# EAGLE design Adafruit TMC2209 Stepper Motor Driver (EAGLE 9.6.2)
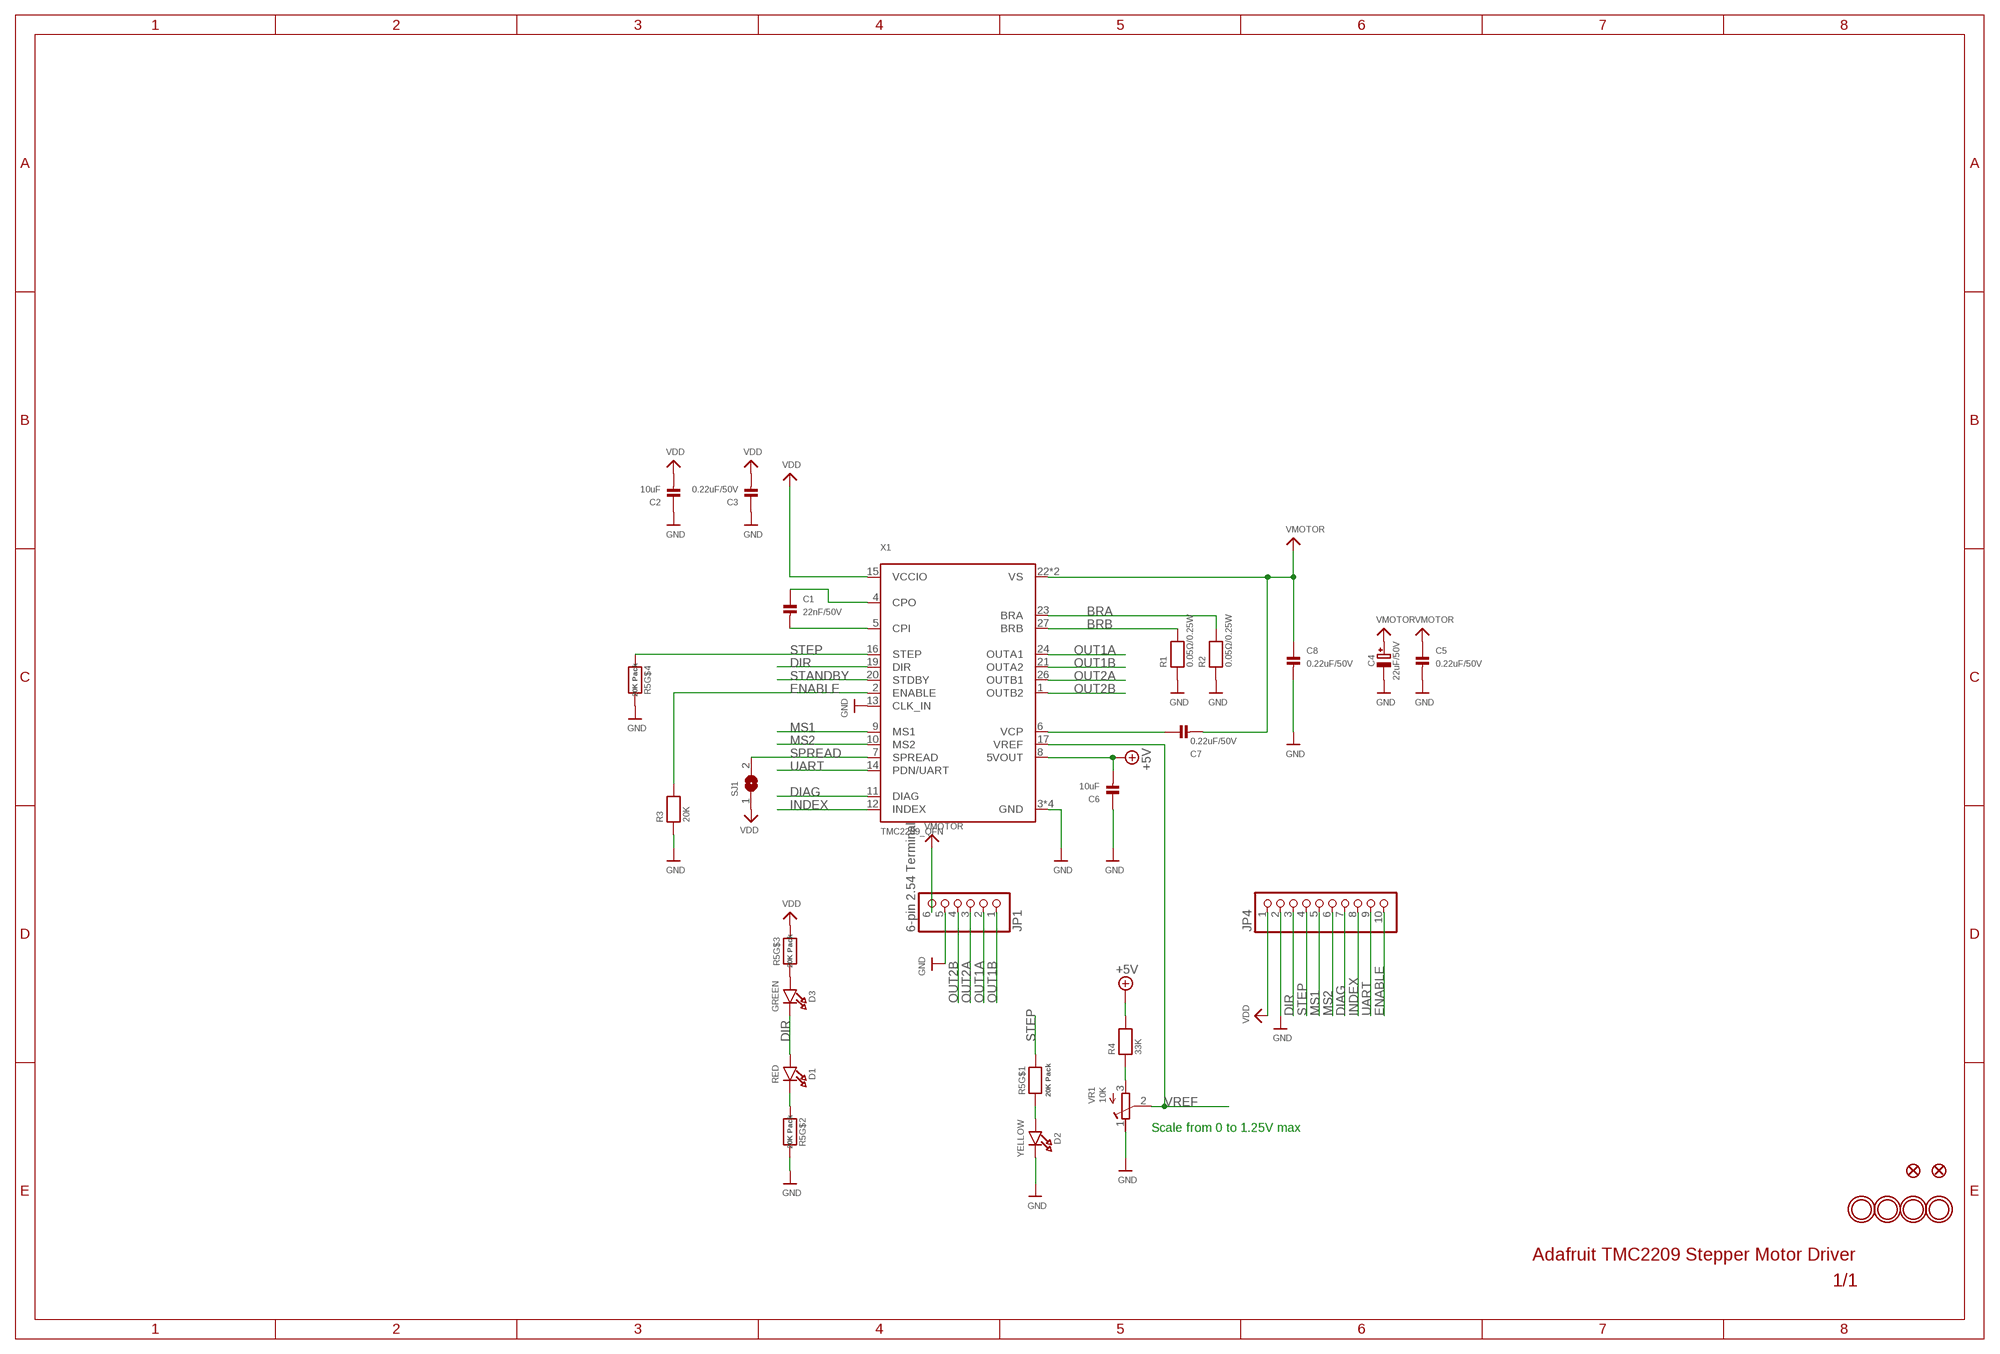
[diagram p0: schematic, sheet 1]

## Parts
C1  22nF/50V  CAP_CERAMIC0603_NO  [0603-NO]
C2  10uF  CAP_CERAMIC0805-NOOUTLINE  [0805-NO]
C3  0.22uF/50V  CAP_CERAMIC0603_NO  [0603-NO]
C4  22uF/50V  CAP_ELECTROLYTICPANASONIC_C  [PANASONIC_C]
C5  0.22uF/50V  CAP_CERAMIC0603_NO  [0603-NO]
C6  10uF  CAP_CERAMIC0805-NOOUTLINE  [0805-NO]
C7  0.22uF/50V  CAP_CERAMIC0603_NO  [0603-NO]
C8  0.22uF/50V  CAP_CERAMIC0603_NO  [0603-NO]
D1  RED  LED0603_NOOUTLINE  [CHIPLED_0603_NOOUTLINE]
D2  YELLOW  LED0603_NOOUTLINE  [CHIPLED_0603_NOOUTLINE]
D3  GREEN  LED0603_NOOUTLINE  [CHIPLED_0603_NOOUTLINE]
JP1  6-pin 2.54 Terminal  HEADER-1X6_2.54MMTERM  [1X06_2.54MMTERMINAL]
JP4  HEADER-1X1070MIL  [1X10_ROUND70]
R1  0.05Ω/0.25W  RESISTOR_0603_NOOUT  [0603-NO]
R2  0.05Ω/0.25W  RESISTOR_0603_NOOUT  [0603-NO]
R3  20K  RESISTOR_0603_NOOUT  [0603-NO]
R4  33K  RESISTOR_0603_NOOUT  [0603-NO]
R5  20K Pack  RESISTOR_4PACK  [RESPACK_4X0603]
SJ1  SOLDERJUMPER  [SOLDERJUMPER_ARROW_NOPASTE]
U$10  FIDUCIAL_0.5MM  [FIDUCIAL_0.5MM]
U$11  FIDUCIAL_0.5MM  [FIDUCIAL_0.5MM]
U$18  MOUNTINGHOLE2.0  [MOUNTINGHOLE_2.0_PLATED]
U$22  MOUNTINGHOLE2.0  [MOUNTINGHOLE_2.0_PLATED]
U$26  MOUNTINGHOLE2.0  [MOUNTINGHOLE_2.0_PLATED]
U$27  MOUNTINGHOLE2.0  [MOUNTINGHOLE_2.0_PLATED]
VR1  10K  R-TRIMM3314J  [RTRIM3314J]
X1  TMC2209_QFN  [QFN28_5MM_MICROCHIP]

## Nets
+5V: C6.2 R4.2 X1.8(5VOUT)
BRA: R2.2 X1.23(BRA)
BRB: R1.2 X1.27(BRB)
DIAG: JP4.7 X1.11(DIAG)
DIR: D1.A D3.C JP4.3 X1.19(DIR)
ENABLE: JP4.10 R3.2 X1.2(ENABLE)
GND: C2.1 C3.1 C4.- C5.2 C6.1 C8.2 D2.C JP1.5 JP4.2 R1.1 R2.1 R3.1 R5.5 R5.7 VR1.1(E) X1.3(GND) X1.13(CLK_IN) X1.18(GND) X1.25(GND) X1.THERMAL(GND)
INDEX: JP4.8 X1.12(INDEX)
MS1: JP4.5 X1.9(MS1)
MS2: JP4.6 X1.10(MS2)
N$1: D2.A R5.1
N$2: C1.1 X1.4(CPO)
N$3: C1.2 X1.5(CPI)
N$4: R4.1 VR1.3(A)
N$7: C7.1 X1.6(VCP)
N$8: D1.C R5.2
N$10: D3.A R5.3
OUT1A: JP1.2 X1.24(OUTA1)
OUT1B: JP1.1 X1.21(OUTA2)
OUT2A: JP1.3 X1.26(OUTB1)
OUT2B: JP1.4 X1.1(OUTB2)
SPREAD: SJ1.2 X1.7(SPREAD)
STANDBY: X1.20(STDBY)
STEP: JP4.4 R5.4 R5.8 X1.16(STEP)
UART: JP4.9 X1.14(PDN/UART)
VDD: C2.2 C3.2 JP4.1 R5.6 SJ1.1 X1.15(VCCIO)
VMOTOR: C4.+ C5.1 C7.2 C8.1 JP1.6 X1.22(VS) X1.28(VS)
VREF: VR1.2(S) X1.17(VREF)

## Notes on the sheet
- Scale from 0 to 1.25V max

## Library data of the parts
C1-C3 C5-C8 = microbuilder:CAP_CERAMIC: Ceramic Capacitors For new designs, use the packages preceded by an '_' character since they are more reliable: The following footprints should be used on most boards: _0402 - Standard footprint for regular board layouts _0603 - Standard footprint for regular board layouts _0805 - Standard footprint for regular board layouts _1206 - Standard footprint for regular board layouts For extremely tight-pitch boards where space is at a premium, the following 'micro-pitch' footprints can be used (smaller pads, no silkscreen outline, etc.): _0402MP - Micro-pitch footprint for very dense/compact boards _0603MP - Micro-pitch footprint for very dense/compact boards _0805MP - Micro-pitch footprint for very dense/compact boards _1206MP - Micro-pitch footprint for very dense/compact boards
C4 = microbuilder:CAP_ELECTROLYTIC: Electrolytic Capacitors SMT PANASONIC_C - Size C Panasonic Electrolytic Aluminum Capacitor 47µF 16V 20% Electrolytic Capacitor [Digikey: PCE3890TR-ND] PANASONIC_D - Size D Panasonic Electrolytic Aluminum Capacitor 100µF 25V 20% Electrolytic Capacitor [Digikey: PCE3898TR-ND] PTH 3.5 mm grid, 8 mm diameter ... 3.5 mm grid, 10 mm diameter ...
D1-D3 = microbuilder:LED: LED 0603 - 0603 Surface Mount Package 2mA: Green LED - Low Power (3.9mcd, 2ma, 1.7Vf) - Digikey: 475-2709-2-ND Orange LED - Low Power (9.8mcd, 2ma, 1.8Vf) - Digikey: 475-1194-2-ND Red LED - Low Power (5mcd, 2ma, 1.8Vf) - Digikey: 475-1195-2-ND Yellow LED - Low Power (7mcd, 2ma, 1.8Vf) - Digikey: 475-1196-2-ND 5mA: Blue LED - Low Power (17mcd, 5ma, 2.9Vf) - Digikey: LNJ937W8CRACT-ND 0805 - 0805 Surface Mount Package 2mA: Red LED (8.8mcd, 2mA, 1.8Vf, Clear) - Low Power [Digikey: 475-2510-1-ND] Green LED (5mcd, 2mA, 1.8Vf, Clear) - Low Power [Digikey: 475-2730-1-ND] Yellow LED (11.3mcd, 2mA, 1.8Vf, Clear) - Low Power [Digikey: 475-2555-1-ND] 20mA: Red LED (104mcd, 20mA, Diffused) - LS R976 [Digikey: 475-1278-6-ND] Red LED (12mcd, 20mA, 2.0Vf, Clear) - APT2012EC [Digikey: 754-1128-1-ND] Green LED (15mcd, 20mA, 2.2Vf, Clear) - APT2012GC [Digikey: 754-1131-1-ND] Orange LED (160mcd, 20mA, 2.1Vf, Clear) - APT2012SECK [Digikey: 754-1130-1-ND] 1206 - 1206 Surface Mount Package Green LED (26mcd, 20mA, Diffused) - LG N971 [Digikey: 475-1407-6-ND] Red LED (15mcd, 20mA, Diffused) - LH N974 [Digikey: 475-1416-6-ND] Cree - Cree High-Power Surface Mount LEDs XPEBWT-L1-0000-00D50 - White 111lm 350mA 2.9Vf 6200K 110° XTEAWT-00-0000-00000LEE3 - White 114lm 350mA 2.85Vf 5000K 115° Everlight - Everlight 45-21 Series Surface Mount LEDs 45-21/QK2C-B2832AC2CB2/2T - Warm White 2000mcd 20mA 3.25Vf 3050K 120° 45-21/LK2C-B38452C4CB2/2T - Nuetral White 2000mcd 20mA 3.25Vf 4150K 120° 45-21/LK2C-B50634C6CB2/2T - Cold White 2200mcd 20mA 3.25Vf 5650K 120° PLCC2 Reverse Mount LS T77K-J1L2-1-0-2-R18-Z - Red 11.25mcd 2mA 1.8Vf 630nm 120° LO T77K-L1M2-24-Z - Orange 19.6mcd 2mA 1.8Vf 606nm 120° LY T77K-K2M1-26-Z - Yellow 15.7mcd 2mA 1.8Vf 587nm 120°; ROT: 270
JP1 = microbuilder:HEADER-1X6: PIN HEADER
JP4 = microbuilder:HEADER-1X10: PIN HEADER
R1-R4 = microbuilder:RESISTOR: Resistors For new designs, use the packages preceded by an '_' character since they are more reliable: The following footprints should be used on most boards: _0402 - Standard footprint for regular board layouts _0603 - Standard footprint for regular board layouts _0805 - Standard footprint for regular board layouts _1206 - Standard footprint for regular board layouts For extremely tight-pitch boards where space is at a premium, the following 'micro-pitch' footprints can be used (smaller pads, no silkscreen outline, etc.): _0402MP - Micro-pitch footprint for very dense/compact boards _0603MP - Micro-pitch footprint for very dense/compact boards _0805MP - Micro-pitch footprint for very dense/compact boards _1206MP - Micro-pitch footprint for very dense/compact boards
R5 = microbuilder:RESISTOR_4PACK: Resistor Packs (4 resistors) 4 x 0603 10K 1/16W - Digikey: YC164J-10KCT-ND
SJ1 = microbuilder:SOLDERJUMPER: SMD Solder JUMPER Solder the two pads together to create a connection, or remove the solder to break it. REFLOW - Use this footprint for solder paste and reflow ovens. WAVE - Use this footprint for hand-soldering (larger pads). CLOSED - Has a trace between the two pads to ensure it is closed by default. The trace needs to be cut to disable the jumper, and can be closed again by creating a solder bridge between the two pads.; BOM: EXCLUDE
U$10 U$11 = microbuilder:FIDUCIAL: Fiducial Alignment Points Various fiducial points for machine vision alignment.
U$18 U$22 U$26 U$27 = adafruit_electromech:MOUNTINGHOLE: Mounting Hole For #2 screws (0.086"/2.18mm width, 0.094"/2.4mm hole) use 2.5mm; BOM: EXCLUDE
VR1 = adafruit_electromech:R-TRIMM: Trimm resistor; SPICEMODEL: X; SPICEPREFIXL: POT
X1 = microbuilder:TMC2209

## Board
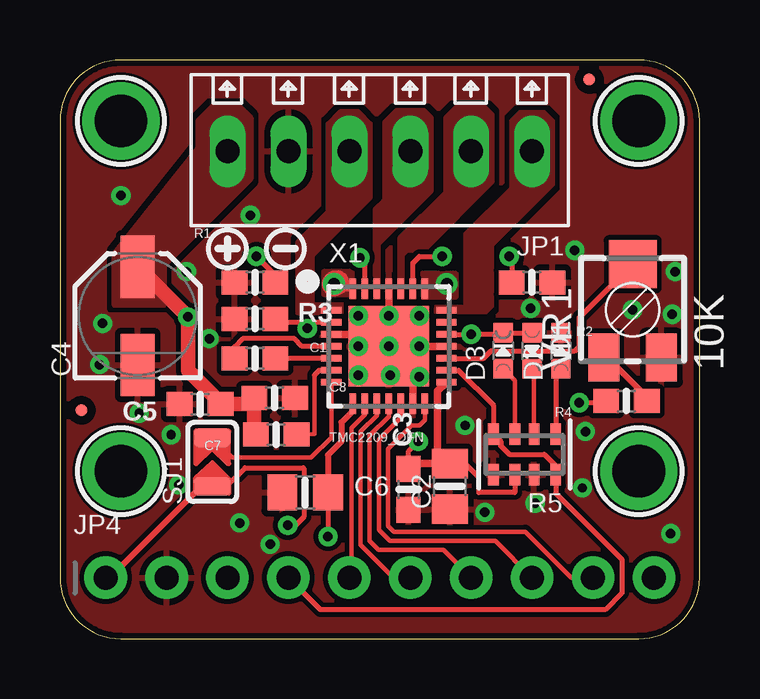
[diagram p1: board, top side]
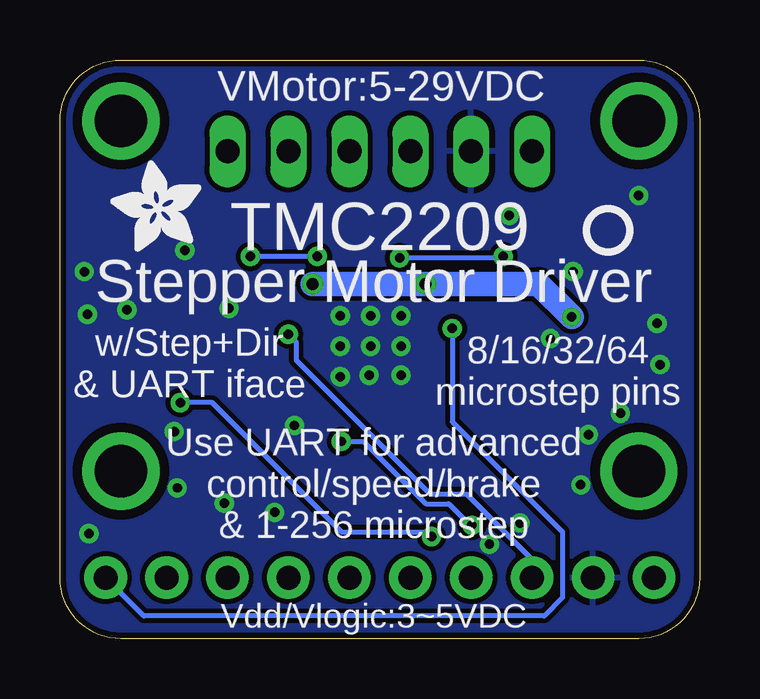
[diagram p2: board, bottom side, seen from below]

Size 26.67 x 24.13 mm. Coordinates in mm from the lower left corner, seen from the top.
Outline: 0,21.59 0,2.54 arc90 2.54,0 24.13,0 arc90 26.67,2.54 26.67,21.59 arc90 24.13,24.13 2.54,24.13 arc90 0,21.59
Copper layers (1*16): Top 0.035mm / dielectric 1.5mm / Bottom 0.035mm
Design rules "adafruit 7-7": minimum track width 7mil, minimum drill 15.5mil, track to track 8mil, track to pad 7mil, pad to pad 7mil, via to via 7mil, smd to smd 7mil, copper to edge 10mil, drill to drill 8mil, minimum pad ring 10mil, minimum via ring 8mil, stop-mask expansion 2mil, vias tented up to drill 20mil, thermal gap 10mil

### Footprints (pad centres in the part's own frame; a part is rotated, then mirrored left to right if it is on the bottom)
0603-NO = smd 1.075 x 1: 1 -0.85,0; 2 0.85,0
0805-NO = smd 1.24 x 1.5: 1 -0.95,0; 2 0.95,0
PANASONIC_C = smd 2.6 x 1.4: + 2.05,0; - -2.05,0
CHIPLED_0603_NOOUTLINE = smd 0.8 x 0.8: A 0,-0.75; C 0,0.75
1X06_2.54MMTERMINAL = drill 1 long: 1 6.35,0; 2 3.81,0; 3 1.27,0; 4 -1.27,0; 5 -3.81,0; 6 -6.35,0
1X10_ROUND70 = drill 1 pad 1.778: 1 -11.43,0; 2 -8.89,0; 3 -6.35,0; 4 -3.81,0; 5 -1.27,0; 6 1.27,0; 7 3.81,0; 8 6.35,0; 9 8.89,0; 10 11.43,0
RESPACK_4X0603 = smd 0.45 x 0.9: 1 -1.3,-0.85; 2 -0.4,-0.85; 3 0.4,-0.85; 4 1.3,-0.85; 5 1.3,0.85; 6 0.4,0.85; 7 -0.4,0.85; 8 -1.3,0.85
SOLDERJUMPER_ARROW_NOPASTE = smd 0.762 x 1.524: 1 -1.016,0; 2 1.016,0
FIDUCIAL_0.5MM = smd 0.5 x 0.5: 1 0,0
MOUNTINGHOLE_2.0_PLATED = drill 2.2 pad 3: P$1 0,0
RTRIM3314J = smd 1.3 x 2: 1 1.2,-2; 3 -1.2,-2 | smd 2 x 2: 2 0,1.9
QFN28_5MM_MICROCHIP = smd 0.85 x 0.27: 1 -2.4,1.5; 2 -2.4,1; 3 -2.4,0.5; 4 -2.4,0; 5 -2.4,-0.5; 6 -2.4,-1; 7 -2.4,-1.5; 15 2.4,-1.5; 16 2.4,-1; 17 2.4,-0.5; 18 2.4,0; 19 2.4,0.5; 20 2.4,1; 21 2.4,1.5 | smd 0.27 x 0.85: 8 -1.5,-2.4; 9 -1,-2.4; 10 -0.5,-2.4; 11 0,-2.4; 12 0.5,-2.4; 13 1,-2.4; 14 1.5,-2.4; 22 1.5,2.4; 23 1,2.4; 24 0.5,2.4; 25 0,2.4; 26 -0.5,2.4; 27 -1,2.4; 28 -1.5,2.4 | smd 3.35 x 3.35: THERMAL 0,0

### Placement (x,y rotation side)
C1  8.13,11.68 0 top
C2  16.26,6.35 90 top
C3  14.54,6.22 90 top
C4  3.24,13.46 90 top
C5  5.84,9.78 180 top
C6  10.22,6.1 0 top
C7  9.02,8.51 180 top
C8  8.95,10.03 0 top
D1  19.68,12 180 top
D2  20.89,12 0 top
D3  18.48,12 0 top
JP1  13.34,20.32 0 top
JP4  13.34,2.54 0 top
PLABEL0  [PLABEL0]  2.03,4.19 0 top
PLABEL1  [PLABEL1]  9.91,0.89 0 top
PLABEL2  [PLABEL2]  7.11,4.19 0 top
PLABEL3  [PLABEL3]  22.35,4.19 0 top
PLABEL4  [PLABEL4]  19.81,0.89 0 top
PLABEL5  [PLABEL5]  24.45,0.89 0 top
PLABEL6  [PLABEL6]  12,4.19 0 top
PLABEL7  [PLABEL7]  14.86,0.89 0 top
PLABEL8  [PLABEL8]  17.14,4.06 0 top
PLABEL9  [PLABEL9]  4.57,0.89 0 top
PLABEL10  [PLABEL10]  12.06,16.32 0 top
PLABEL11  [PLABEL11]  14.67,16.32 0 top
PLABEL12  [PLABEL12]  17.27,16.32 0 top
PLABEL13  [PLABEL13]  19.94,16.26 0 top
PLABEL14  [PLABEL14]  23.94,18.8 0 top
PLABEL15  [PLABEL15]  24,17.4 0 top
PLABEL16  [PLABEL16]  2.6,18.29 0 top
PLABEL17  [PLABEL17]  18.41,10.1 0 top
PLABEL18  [PLABEL18]  19.75,10.1 0 top
PLABEL19  [PLABEL19]  20.89,10.1 0 top
PLABEL20  [PLABEL20]  8,6.67 90 top
R1  8.13,14.86 0 top
R2  19.68,14.86 180 top
R3  8.13,13.34 0 top
R4  23.62,9.91 180 top
R5  19.37,7.68 180 top
SJ1  6.35,7.37 90 top
U$7  [SYMBOL_PLUS]  6.99,16.26 0 top
U$8  [SYMBOL_MINUS]  9.4,16.26 0 top
U$10  22.07,23.32 0 top
U$11  0.89,9.53 0 top
U$12  [PCBFEAT-REV-040]  3.81,17.02 0 bottom
U$18  2.54,21.59 0 top
U$22  24.13,21.59 0 top
U$24  [ADAFRUIT_3.5MM]  20.76,16.13 90 bottom
U$26  2.54,6.99 0 top
U$27  24.13,6.99 0 top
VR1  23.88,13.72 0 top
X1  13.72,12.19 0 top

### Tracks (layer width: path | path; a pad name or v marks a point on that pad's centre or on a via)
+5V  (via drill 0.39)
  Top 0.203: C6.2 v11.18,4.25 | v21.65,9.84 22.71,9.84 R4.2
  Top 0.254: X1.8 12.22,9.5 11.73,9.02 11.73,8.22 11.17,7.66 C6.2
  Bottom 0.203: v11.18,4.25 11.37,4.45 14.92,4.45 20.32,9.84 v21.65,9.84
BRA  (via drill 0.39)
  Top 0.203: X1.23 14.72,15.67 14.99,15.94 v15.94,15.94 | v18.73,15.94 18.84,15.84 R2.2
  Bottom 0.203: v15.94,15.94 v18.73,15.94
BRB  (via drill 0.39)
  Top 0.203: X1.27 12.72,15.68 v12.51,15.88 | v8.19,15.94 8.98,15.15 R1.2
  Bottom 0.203: v12.51,15.88 8.25,15.88 v8.19,15.94
DIAG
  Top 0.178: X1.11 13.72,9.27 12.92,8.47 12.92,4.07 13.29,3.7 15.99,3.7 JP4.7
DIR  (via drill 0.39)
  Top 0.203: X1.19 v17.14,12.69 18.42,12.69 D3.C D1.A
  Bottom 0.203: v17.14,12.69 16.82,12.37 16.82,11.61 11.24,6.03 9.72,6.03 6.99,3.3 JP4.3
ENABLE  (via drill 0.39)
  Top 0.203: X1.2 10.48,13.19 | 10.48,13.19 9.12,13.19 R3.2 | 10.48,13.19 10.31,13.03 v10.31,12.94
  Bottom 0.203: v10.31,12.94 10.31,9.04 5.71,4.45 5.71,1.71 6.48,0.95 23.18,0.95 JP4.10
GND  (via drill 0.39)
  Top 0.305: X1.13 14.72,11.19 X1.THERMAL | X1.3 13.22,12.69 13.53,12.38 | 13.53,12.38 X1.THERMAL | X1.18 X1.THERMAL | X1.25 13.72,12.57 13.53,12.38
  other vias: 16.89,8.89 17.72,5.27 19.81,5.65 12.45,10.99 13.78,10.99 13.72,12.19 13.72,13.46 12.45,13.46 12.45,12.19 14.99,13.46 14.99,12.19 14.99,10.92 19.62,13.78 21.46,16.19 23.88,13.72 25.65,15.3 25.53,13.53 21.91,8.64 21.78,6.29 25.46,4.38 8.76,3.94 7.49,4.83 4.64,8.51 3.3,9.4 1.65,11.43 1.78,13.14 2.54,18.48 5.27,15.3 7.94,17.65 6.22,12.51 4.95,6.41
  pour Top (rank 6): 0,24.13 26.67,24.13 26.67,0 0,0
  pour Bottom (rank 6): 0,24.13 26.67,24.13 26.67,0 0,0
INDEX
  Top 0.178: X1.12 14.22,9.23 13.3,8.31 13.3,4.54 13.77,4.08 18.15,4.08 JP4.8
MS1
  Top 0.178: X1.9 12.72,9.35 12.15,8.79 12.15,2.63 JP4.5
MS2
  Top 0.178: X1.10 13.22,9.31 12.54,8.63 12.54,3.91 13.91,2.54 JP4.6
N$1
  Top 0.203: D2.A 20.67,11.03 R5.1
N$2
  Top 0.203: X1.4 10.1,12.19 9.78,12.51 7.62,12.51 7.28,12.17 C1.1
N$3
  Top 0.203: X1.5 8.99,11.69 C1.2
N$4
  Top 0.254: VR1.3 22.83,11.72 24.47,10.07 R4.1
N$7
  Top 0.178: 10.61,10.99 10.61,8.54 C7.1
  Top 0.203: X1.6 10.81,11.19 10.61,10.99
N$8
  Top 0.178: D1.C 19.77,11.17 R5.2
N$10
  Top 0.178: D3.A 18.97,10.76 R5.3
OUT1A
  pour Top (no thermals): 14.16,14.73 14.16,16.7 16.07,18.61 16.07,21.72 16.51,22.16 17.72,22.16 18.03,21.84 18.03,19.05 15.18,16.19 14.48,16.19 14.29,16 14.29,14.73
OUT1B
  pour Top (no thermals): 15.62,13.59 17.78,13.59 18.03,13.84 18.03,16.38 20.57,18.92 20.57,21.59 20.19,21.97 19.18,21.97 18.8,21.59 18.8,18.8 16.89,16.89 16.89,13.84 15.62,13.84
OUT2A
  pour Top (no thermals): 13.14,14.67 13.14,17.91 13.53,18.29 13.53,21.53 14.03,22.03 15.18,22.03 15.49,21.72 15.49,18.67 13.27,16.45 13.27,14.67
OUT2B
  pour Top (no thermals): 9.91,13.59 11.75,13.59 11.87,13.72 11.87,13.91 10.54,13.91 10.54,16 12.95,18.41 12.95,21.46 12.45,21.97 11.68,21.97 11.18,21.46 11.18,17.78 9.91,16.51
SPREAD
  Top 0.178: X1.7 11.32,8.39 10.48,7.56 7.18,7.56 SJ1.2
STEP
  Top 0.203: X1.16 16.62,11.19 18.07,9.74 R5.4 18.39,8.22 18.39,8.03 18.73,7.68 20.19,7.68 20.67,7.21 R5.8 20.67,6.07 23.43,3.3 23.43,1.91 22.73,1.21 10.86,1.21 JP4.4
UART
  Top 0.178: X1.14 15.22,9.12 14.99,8.89 14.66,8.89 13.68,7.9 13.68,4.7 13.92,4.46 19.4,4.46 21.32,2.54 JP4.9
VDD  (via drill 0.39)
  Top 0.203: R5.6 18.97,6.1 17.46,6.1 17.46,6.73 16.7,7.49 16.45,7.49 | C3.2 14.54,7.82 v14.94,8.22 | v9.5,4.73 9.81,4.73 10.17,5.08 10.17,7.09 10.14,7.12 7.71,7.12 6.94,6.35 SJ1.1
  Top 0.254: JP4.1 2.08,2.54 5.76,6.22 6.22,6.22 SJ1.1
  Top 0.305: X1.15 15.75,10.32 15.75,7.81 C2.2 | C2.2 14.77,7.3 C3.2 | 16.45,7.49 C2.2
  Bottom 0.203: v14.94,8.22 14.01,8.22 11.41,5.63 10.46,5.63 9.56,4.73 v9.5,4.73
VMOTOR  (via drill 0.39, 0.5)
  Top 0.254: X1.28 11.82,14.59 11.56,14.86
  Top 0.61: C7.2 8.1,8.57 C8.1 7.85,9.78 C5.1 6.69,9.82 5.33,11.18 v5.33,13.42 C4.+
  Top 1.016: 11.56,14.86 11.49,14.86 v11.43,14.8
  Bottom 1.016: v16.13,14.8 v11.43,14.8 6.71,14.8 v5.33,13.42
  pour Top (no thermals): 15.11,14.22 15.11,15.24 16.51,15.24 16.51,14.22
  pour Top (no thermals): 10.99,14.35 12.19,14.35 12.19,15.3 10.99,15.3
  pour Top (no thermals): 7.43,22.23 7.94,21.72 7.94,19.18 4.32,15.56 4.32,13.91 2.29,13.91 2.29,16.07 5.78,20.45 5.78,21.59 6.41,22.23
VREF
  Top 0.203: X1.17 17.66,11.69 17.97,12 21.46,12 21.65,12.19 21.65,13.39 VR1.2

### Text on the board
bPlace: VMotor:5-29VDC | TMC2209 | Stepper Motor Driver | 8/16/32/64 / microstep pins | w/Step+Dir / & UART iface | Use UART for advanced / control/speed/brake / & 1-256 microstep | Vdd/Vlogic:3~5VDC
Pinguin_tBackup: ILimit | TMC / 2209 | 0->2A | 2B | 2A | 1A | 1B | F | B | S | SPRD | VDD | DIR | MS1 | DIAG | UART | GND | STEP | MS2 | INDEX | EN